# EAGLE design ncat (EAGLE 8.0.1)
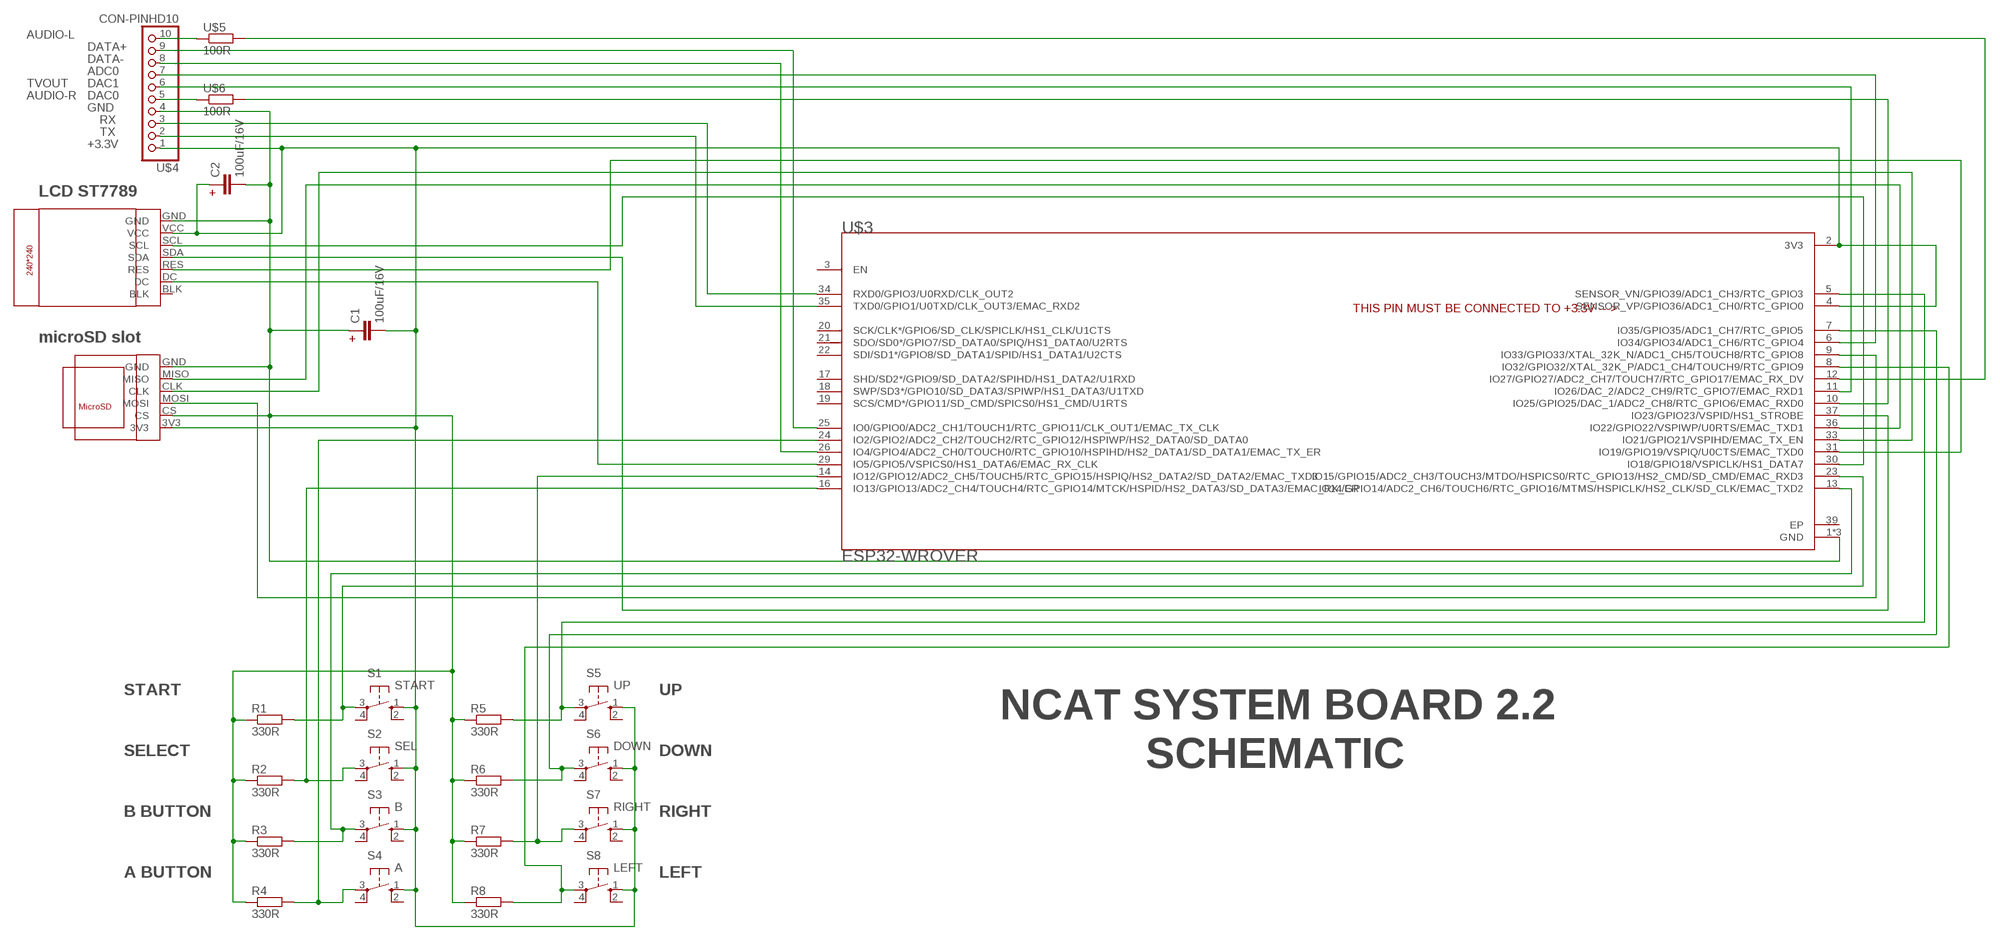
[diagram p0: schematic, sheet 1]

## Parts
C1  100uF/16V  C-EUC1210  [C1210]
C2  100uF/16V  C-EUC1210  [C1210]
R1  330R  RESISTORR204/5H  [R0204/5H]
R2  330R  RESISTORR204/5H  [R0204/5H]
R3  330R  RESISTORR204/5H  [R0204/5H]
R4  330R  RESISTORR204/5H  [R0204/5H]
R5  330R  RESISTORR204/5H  [R0204/5H]
R6  330R  RESISTORR204/5H  [R0204/5H]
R7  330R  RESISTORR204/5H  [R0204/5H]
R8  330R  RESISTORR204/5H  [R0204/5H]
S1  START  10-XX  [B3F-10XX]
S2  SEL  10-XX  [B3F-10XX]
S3  B  10-XX  [B3F-10XX]
S4  A  10-XX  [B3F-10XX]
S5  UP  10-XX  [B3F-10XX]
S6  DOWN  10-XX  [B3F-10XX]
S7  RIGHT  10-XX  [B3F-10XX]
S8  LEFT  10-XX  [B3F-10XX]
U$1  MICROSD-CARD-MODULESMD  [MICROSD-CARD-MODULE-SMD]
U$3  ESP32-WROVER  [XCVR-ESP32-WROVER]
U$4  CON-PINHD10  [PIN1X10]
U$5  100R  RESISTORR1206/SMD  [R1206/SMD]
U$6  100R  RESISTORR1206/SMD  [R1206/SMD]
U$7  LCD-ST7789-1.3INCH  [LCD-ST7789-1.3INCH]

## Nets
N$1: U$3.35(TXD0/GPIO1/U0TXD/CLK_OUT3/EMAC_RXD2) U$4.2
N$2: U$3.34(RXD0/GPIO3/U0RXD/CLK_OUT2) U$4.3
N$3: U$3.12(IO27/GPIO27/ADC2_CH7/TOUCH7/RTC_GPIO17/EMAC_RX_DV) U$5.2
N$4: U$4.5 U$6.1
N$5: U$4.10 U$5.1
N$6: U$3.11(IO26/DAC_2/ADC2_CH9/RTC_GPIO7/EMAC_RXD1) U$4.6
N$7: R8.2 S8.3(P) U$3.8(IO32/GPIO32/XTAL_32K_P/ADC1_CH4/TOUCH9/RTC_GPIO9)
N$12: R4.2 S4.3(P) U$3.24(IO2/GPIO2/ADC2_CH2/TOUCH2/RTC_GPIO12/HSPIWP/HS2_DATA0/SD_DATA0)
N$17: U$3.10(IO25/GPIO25/DAC_1/ADC2_CH8/RTC_GPIO6/EMAC_RXD0) U$6.2
N$18: U$3.30(IO18/GPIO18/VSPICLK/HS1_DATA7) U$7.SCL
N$19: U$3.37(IO23/GPIO23/VSPID/HS1_STROBE) U$7.SDA
N$20: U$3.31(IO19/GPIO19/VSPIQ/U0CTS/EMAC_TXD0) U$7.RES
N$21: R5.2 S5.3(P) U$3.5(SENSOR_VN/GPIO39/ADC1_CH3/RTC_GPIO3)
N$22: R2.2 S2.3(P) U$3.16(IO13/GPIO13/ADC2_CH4/TOUCH4/RTC_GPIO14/MTCK/HSPID/HS2_DATA3/SD_DATA3/EMAC_RX_ER)
N$24: R3.2 S3.3(P) U$3.13(IO14/GPIO14/ADC2_CH6/TOUCH6/RTC_GPIO16/MTMS/HSPICLK/HS2_CLK/SD_CLK/EMAC_TXD2)
N$46: U$1.MOSI U$3.9(IO33/GPIO33/XTAL_32K_N/ADC1_CH5/TOUCH8/RTC_GPIO8)
N$63: U$3.29(IO5/GPIO5/VSPICS0/HS1_DATA6/EMAC_RX_CLK) U$7.DC
N$64: U$1.MISO U$3.36(IO22/GPIO22/VSPIWP/U0RTS/EMAC_TXD1)
N$65: U$1.CLK U$3.33(IO21/GPIO21/VSPIHD/EMAC_TX_EN)
N$66: R6.2 S6.3(P) U$3.7(IO35/GPIO35/ADC1_CH7/RTC_GPIO5)
N$68: R1.2 S1.3(P) U$3.23(IO15/GPIO15/ADC2_CH3/TOUCH3/MTDO/HSPICS0/RTC_GPIO13/HS2_CMD/SD_CMD/EMAC_RXD3)
N$69: U$3.6(IO34/GPIO34/ADC1_CH6/RTC_GPIO4) U$4.7
N$70: U$3.26(IO4/GPIO4/ADC2_CH0/TOUCH0/RTC_GPIO10/HSPIHD/HS2_DATA1/SD_DATA1/EMAC_TX_ER) U$4.8
N$71: U$3.25(IO0/GPIO0/ADC2_CH1/TOUCH1/RTC_GPIO11/CLK_OUT1/EMAC_TX_CLK) U$4.9
N$72: C1.2 C2.1 S1.1(S) S2.1(S) S3.1(S) S4.1(S) S5.1(S) S6.1(S) S7.1(S) S8.1(S) U$1.3V3 U$3.2(3V3) U$3.4(SENSOR_VP/GPIO36/ADC1_CH0/RTC_GPIO0) U$4.1 U$7.VCC
N$73: R7.2 S7.3(P) U$3.14(IO12/GPIO12/ADC2_CH5/TOUCH5/RTC_GPIO15/HSPIQ/HS2_DATA2/SD_DATA2/EMAC_TXD3)
N$77: C1.1 C2.2 R1.1 R2.1 R3.1 R4.1 R5.1 R6.1 R7.1 R8.1 U$1.CS U$1.GND U$3.1(GND) U$3.15(GND) U$3.38(GND) U$4.4 U$7.GND
Unconnected: S1.2(S1) S1.4(P1) S2.2(S1) S2.4(P1) S3.2(S1) S3.4(P1) S4.2(S1) S4.4(P1) S5.2(S1) S5.4(P1) S6.2(S1) S6.4(P1) S7.2(S1) S7.4(P1) S8.2(S1) S8.4(P1) U$3.3(EN) U$3.17(SHD/SD2*/GPIO9/SD_DATA2/SPIHD/HS1_DATA2/U1RXD) U$3.18(SWP/SD3*/GPIO10/SD_DATA3/SPIWP/HS1_DATA3/U1TXD) U$3.19(SCS/CMD*/GPIO11/SD_CMD/SPICS0/HS1_CMD/U1RTS) U$3.20(SCK/CLK*/GPIO6/SD_CLK/SPICLK/HS1_CLK/U1CTS) U$3.21(SDO/SD0*/GPIO7/SD_DATA0/SPIQ/HS1_DATA0/U2RTS) U$3.22(SDI/SD1*/GPIO8/SD_DATA1/SPID/HS1_DATA1/U2CTS) U$7.BLK

## Notes on the sheet
- AUDIO-L
- DATA+
- DATA-
- ADC0
- TVOUT | DAC1
- AUDIO-R | DAC0
- GND
- RX
- TX
- +3.3V
- LCD ST7789 | +
- THIS PIN MUST BE CONNECTED TO +3.3V --->
- microSD slot | +
- START | UP
- NCAT SYSTEM BOARD 2.2
- SELECT | DOWN
- SCHEMATIC
- B BUTTON | RIGHT
- A BUTTON | LEFT

## Power pins joined to a net without a drawn wire
EP: U$3.39(EP)

## Library data of the parts
C1 C2 = resistor:C-EU: CAPACITOR, European symbol
R1-R8 U$5 U$6 = ncat:RESISTOR
S1-S8 = switch-omron:10-XX: OMRON SWITCH; MPN: B3F-1000; OC_FARNELL: 176432; OC_NEWARK: 36M3542
U$1 = MICROSD-CARD-MODULE_new:MICROSD-CARD-MODULE
U$3 = ncat:ESP32-WROVER
U$4 = ncat:CON-PINHD10
U$7 = ncat:LCD-ST7789-1.3INCH

## Board
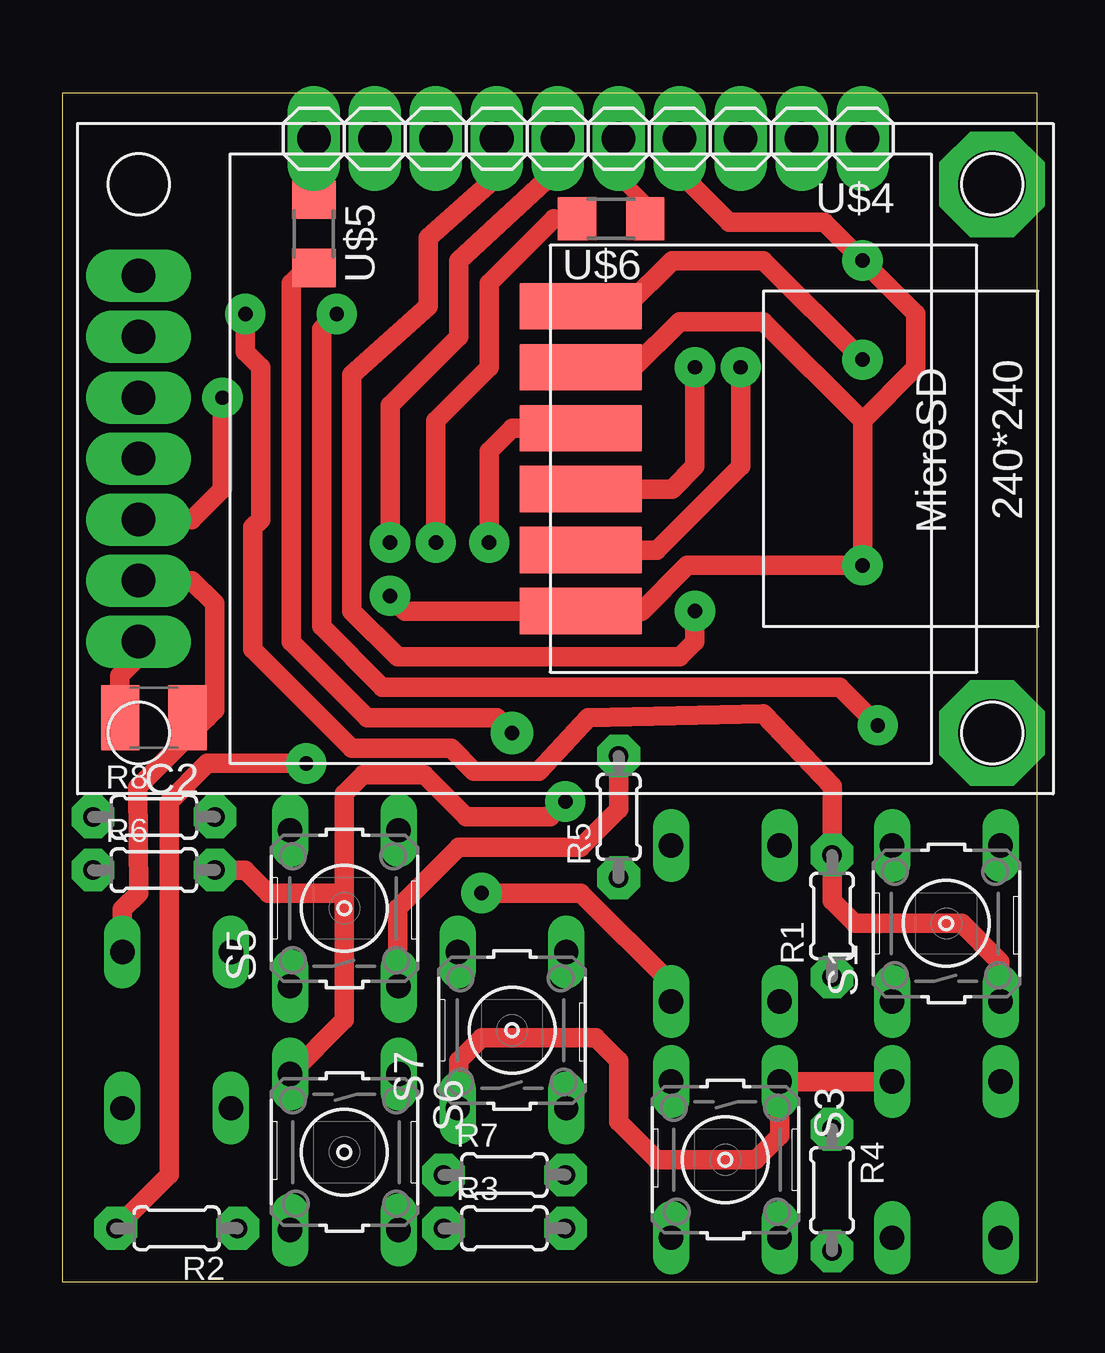
[diagram p1: board, top side]
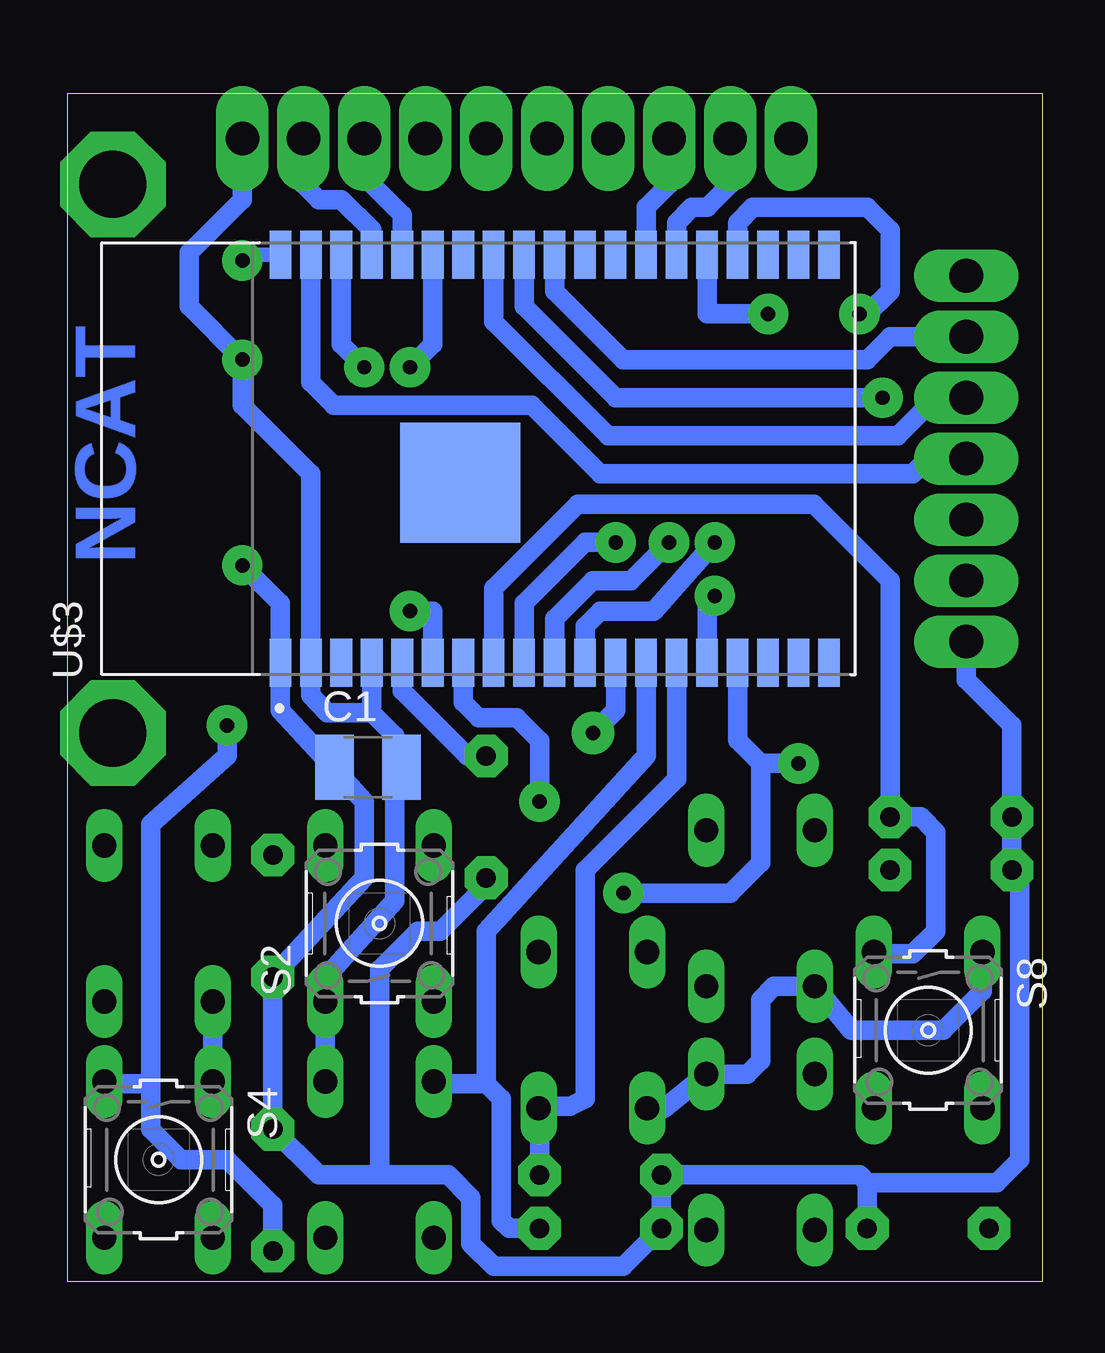
[diagram p2: board, bottom side, seen from below]

Size 40.62 x 49.52 mm. Coordinates in mm from the lower left corner, seen from the top.
Outline: 0,0 40.62,0 40.62,49.52 0,49.52 0,0
Copper layers (1*16): Top 0.035mm / dielectric 1.5mm / Bottom 0.035mm
Design rules "default": minimum track width 10mil, minimum drill 24mil, track to track 8mil, track to pad 8mil, pad to pad 8mil, via to via 8mil, smd to smd 8mil, copper to edge 40mil, drill to drill 8mil, minimum pad ring 10mil, minimum via ring 8mil, stop-mask expansion 4mil, vias tented up to drill 0mil, thermal gap 10mil

### Footprints (pad centres in the part's own frame; a part is rotated, then mirrored left to right if it is on the bottom)
C1210 = smd 1.6 x 2.7: 1 -1.4,0; 2 1.4,0
R0204/5H = drill 0.813 pad 1.778 octagon: 1 -2.54,0; 2 2.54,0
B3F-10XX = drill 1.016 long: 1 -3.251,2.261; 2 3.251,2.261; 3 -3.251,-2.261; 4 3.251,-2.261
MICROSD-CARD-MODULE-SMD = smd 1.93 x 5.08: 3V3 -6.35,-8.89; CLK 1.27,-8.89; CS -3.81,-8.89; GND 6.35,-8.89; MISO 3.81,-8.89; MOSI -1.27,-8.89
XCVR-ESP32-WROVER = smd 2 x 0.9: 1 -8.5,8.26; 2 -8.5,6.99; 3 -8.5,5.72; 4 -8.5,4.45; 5 -8.5,3.18; 6 -8.5,1.91; 7 -8.5,0.64; 8 -8.5,-0.63; 9 -8.5,-1.9; 10 -8.5,-3.17; 11 -8.5,-4.44; 12 -8.5,-5.71; 13 -8.5,-6.98; 14 -8.5,-8.25; 15 -8.5,-9.52; 16 -8.5,-10.79; 17 -8.5,-12.06; 18 -8.5,-13.33; 19 -8.5,-14.6; 20 8.5,-14.6; 21 8.5,-13.33; 22 8.5,-12.06; 23 8.5,-10.79; 24 8.5,-9.52; 25 8.5,-8.25; 26 8.5,-6.98; 27 8.5,-5.71; 28 8.5,-4.44; 29 8.5,-3.17; 30 8.5,-1.9; 31 8.5,-0.63; 32 8.5,0.64; 33 8.5,1.91; 34 8.5,3.18; 35 8.5,4.45; 36 8.5,5.72; 37 8.5,6.99; 38 8.5,8.26 | smd 5 x 5: 39 -1,0.76
PIN1X10 = drill 1.4 pad 2.184 long: 1 -11.43,0; 2 -8.89,0; 3 -6.35,0; 4 -3.81,0; 5 -1.27,0; 6 1.27,0; 7 3.81,0; 8 6.35,0; 9 8.89,0; 10 11.43,0
R1206/SMD = smd 1.6 x 1.803: 1 -1.422,0; 2 1.422,0
LCD-ST7789-1.3INCH = drill 1.4 pad 2.184 long: BLK -7.62,-19.05; DC -5.08,-19.05; GND 7.62,-19.05; RES -2.54,-19.05; SCL 2.54,-19.05; SDA 0,-19.05; VCC 5.08,-19.05

### Placement (x,y rotation side)
C1  28.1,21.43 0 bottom
C2  3.81,23.5 180 top
R1  32.07,15.24 90 top
R2  4.76,2.22 180 top
R3  18.41,2.22 0 top
R4  32.07,3.81 270 top
R5  23.18,19.37 90 top
R6  3.81,17.14 0 top
R7  18.41,4.45 0 top
R8  3.81,19.37 0 top
S1  36.83,14.92 90 top
S2  27.62,14.92 90 bottom
S3  27.62,5.08 270 top
S4  36.83,5.08 270 bottom
S5  11.75,15.56 90 top
S6  11.75,5.4 270 top
S7  18.73,10.48 90 top
S8  4.76,10.48 270 bottom
U$1  30.48,34.29 270 top
U$3  23.5,34.29 90 bottom
U$4  21.91,47.62 180 top
U$5  10.48,43.66 270 top
U$6  22.86,44.29 180 top
U$7  22.23,34.29 270 top

### Tracks (layer width: path | path; a pad name or v marks a point on that pad's centre or on a via)
N$1
  Bottom 0.813: U$3.35 27.95,43.82 29.21,45.09 30.16,45.09 30.8,45.72 U$4.2
N$2
  Bottom 0.813: U$4.3 28.26,46.04 26.67,44.45 U$3.34
N$3  (via drill 0.6 pad 1.78)
  Top 0.61: U$5.2 10.48,42.55
  Top 0.813: 10.48,42.55 9.53,41.59 9.53,26.67 12.7,23.5 18.1,23.5 v18.73,22.86
  Bottom 0.813: v18.73,22.86 17.78,23.81 U$3.12
N$4
  Top 0.61: U$6.1 24.28,44.93 23.18,46.04 U$4.5
N$5
  Top 0.61: U$5.1 U$4.10
N$6  (via drill 0.6 pad 1.68)
  Top 0.813: v13.65,30.8 13.65,36.51 16.51,39.37 16.51,42.55 20.64,46.35 U$4.6
  Bottom 0.813: U$3.11 19.05,27.3 18.41,27.94 16.19,27.94 v13.65,30.8
N$7
  Bottom 0.813: S8.3 6.95,13.65 5.4,13.65 4.45,14.61 4.45,18.73 5.08,19.37 R8.2 6.35,29.21 9.53,32.38 19.37,32.38 22.86,28.89 U$3.8
N$12  (via drill 0.6 pad 1.68)
  Top 0.813: v11.43,40.32 10.79,39.69 10.79,27.3 13.34,24.77 32.38,24.77 v33.97,23.18
  Bottom 0.813: 37.15,8.26 37.15,6.35 35.88,5.08 33.97,5.08 32.07,3.17 R4.2 | U$3.24 13.97,40.33 v11.43,40.32 | v33.97,23.18 33.97,21.91 37.15,19.05 37.15,8.26 | 37.15,8.26 39.01,8.26 S4.3
N$17  (via drill 0.6 pad 1.68)
  Top 0.61: U$6.2 20.48,44.29
  Top 0.813: 20.48,44.29 17.78,41.59 17.78,38.1 15.56,35.88 v15.56,30.8
  Bottom 0.813: v15.56,30.8 17.14,29.21 18.73,29.21 20.32,27.62 U$3.10
N$18  (via drill 0.6 pad 1.68)
  Top 0.813: v6.67,36.83 6.67,33.02 5.4,31.75 U$7.SCL
  Bottom 0.813: U$3.30 21.59,40.65 17.78,36.83 v6.67,36.83
N$19
  Bottom 0.813: U$7.SDA 4.76,34.29 5.4,33.66 18.41,33.66 21.27,36.51 29.53,36.51 30.48,37.47 U$3.37
N$20
  Bottom 0.813: U$7.RES 4.45,36.83 6.03,35.24 18.1,35.24 22.86,40.01 U$3.31
N$21
  Top 0.813: S5.3 13.97,12.34 13.97,15.56 16.51,18.1 21.59,18.1 23.18,19.68 R5.2
  Bottom 0.813: U$3.5 26.68,24.61 23.97,21.91 R5.2 22.86,21.91
N$22  (via drill 0.6 pad 1.68)
  Top 0.813: v17.46,16.19 21.59,16.19 25.4,12.38 25.4,11.71 S2.3 | v10.16,21.59 6.03,21.59 4.45,20 4.45,4.45 R2.2
  Bottom 0.813: U$3.16 12.71,22.55 11.75,21.59 | 11.75,21.59 11.75,17.46 13.02,16.19 v17.46,16.19 | 11.75,21.59 v10.16,21.59
N$24
  Bottom 0.813: U$3.13 16.52,21.9 23.18,14.61 23.18,8.26 | 23.18,8.26 22.54,7.62 22.54,2.54 22.23,2.22 R3.2 | 23.18,8.26 25.29,8.26 S3.3
N$46  (via drill 0.6 pad 1.68)
  Top 0.813: U$1.MOSI 18.73,35.56 17.78,34.61 v17.78,30.8
  Bottom 0.813: U$3.9 21.59,26.98 21.59,28.26 19.05,30.8 v17.78,30.8
N$63
  Bottom 0.813: U$7.DC 6.35,39.37 7.3,38.42 17.46,38.42 20.32,41.27 U$3.29
N$64  (via drill 0.6 pad 1.68)
  Top 0.813: v28.26,38.1 28.26,33.97 24.77,30.48 U$1.MISO
  Bottom 0.813: U$3.36 29.21,39.06 v28.26,38.1
N$65  (via drill 0.6 pad 1.68)
  Top 0.813: v26.35,38.1 26.35,33.97 25.4,33.02 U$1.CLK
  Bottom 0.813: U$3.33 25.41,39.05 v26.35,38.1
N$66  (via drill 0.6 pad 1.68)
  Top 0.813: v20.95,20 20.32,19.37 16.83,19.37 15.08,21.11 12.54,21.11 11.75,20.32 11.75,16.19 | 11.75,16.19 11.75,10.91 S6.3 | R6.2 7.62,17.14 8.57,16.19 11.75,16.19
  Bottom 0.813: U$3.7 24.14,24.14 23.5,23.5 21.91,23.5 20.95,22.54 v20.95,20
N$68  (via drill 0.6 pad 1.68)
  Top 0.813: v7.62,40.32 7.62,38.73 8.26,38.1 8.26,31.75 7.94,31.43 7.94,26.35 12.06,22.23 16.19,22.23 17.14,21.27 19.84,21.27 21.91,23.5 29.21,23.65 32.07,20.64 R1.2 32.07,15.88 33.02,14.92 37.47,14.92 39.05,13.34 39.05,11.71 S1.3
  Bottom 0.813: U$3.23 12.71,44.13 12.06,44.77 7.3,44.77 6.35,43.81 6.35,41.27 7.3,40.32 v7.62,40.32
N$69  (via drill 0.6 pad 1.68)
  Top 0.813: v26.35,27.94 26.35,26.67 25.72,26.04 13.97,26.04 12.06,27.94 12.06,37.78 15.24,40.64 15.24,43.5 18.1,46.04 U$4.7
  Bottom 0.813: U$3.6 25.41,27.93 25.4,27.94 v26.35,27.94
N$70
  Bottom 0.813: U$4.8 15.56,45.72 16.51,44.77 U$3.26
N$71
  Bottom 0.813: U$3.25 15.24,44.13 14.61,44.77 13.97,44.77 13.02,45.72 U$4.9
N$72  (via drill 0.6 pad 1.68)
  Top 0.813: S4.1 S3.1 29.88,6.07 28.89,5.08 24.77,5.08 23.18,6.67 23.18,9.21 22.23,10.16 17.46,10.16 16.51,9.21 16.51,7.26 S7.1 | v33.34,38.42 29.21,42.55 25.4,42.55 23.5,40.64 U$1.3V3 | S8.1 2.5,15.52 3.17,16.19 3.14,20.6 6.03,23.5 | 6.03,23.5 6.35,23.81 6.35,28.26 5.4,29.21 U$7.VCC | C2.1 6.03,23.65 6.03,23.5
  Bottom 0.813: U$3.4 27.95,23.7 | S7.1 15.75,7.23 S6.1 12.31,8.65 11.75,9.21 11.75,11.75 11.19,12.31 S5.1 7.98,10.48 4.13,10.48 2.5,12.1 S8.1 | 34.49,8.26 S4.1 S1.1 | 29.96,8.26 S3.1 S2.1 29.84,11.71 29.84,12.7 26.99,15.88 26.99,21.43 | U$4.1 33.34,45.09 35.56,42.86 35.56,40.64 v33.34,38.42 33.34,36.51 30.48,33.66 U$3.2 30.48,24.44 29.8,23.7 27.95,23.7 | 27.95,23.7 26.99,22.74 26.99,21.43 | C1.2 26.99,21.43
N$73
  Bottom 0.813: R7.2 20.95,7.19 S7.3 20.92,7.3 19.68,7.3 19.05,7.62 19.05,17.14 15.24,20.95 U$3.14
N$74  (via drill 2.8 pad 4.4)
  other vias: 38.73,45.72
N$75  (via drill 2.8 pad 4.4)
  other vias: 38.73,22.86
N$77  (via drill 0.6 pad 1.68)
  Top 0.813: U$4.4 25.72,46.2 27.78,44.13 31.75,44.13 v33.34,42.55 35.56,40.32 35.56,38.1 33.34,35.88 | v13.65,28.57 14.29,27.94 U$1.GND 24.13,27.94 26.04,29.84 v33.34,29.84 33.34,35.88 | U$1.CS 23.81,38.1 25.72,40.01 29.21,40.01 33.34,35.88 | C2.2 2.38,25.08 2.38,25.24 3.17,26.04 U$7.GND
  Bottom 0.61: U$3.38 33.02,42.79 v33.34,42.55
  Bottom 0.813: 29.47,21.32 28.26,20 28.26,16.83 R1.1 R4.1 30.16,4.45 27.62,4.45 | 29.47,21.32 31.75,23.81 U$3.1 31.75,28.26 v33.34,29.84 | U$3.15 13.97,28.25 v13.65,28.57 | U$7.GND 3.17,25.08 1.27,23.18 R8.1 R6.1 0.95,16.83 0.95,5.08 1.91,4.13 7.3,4.13 | 7.3,4.13 7.62,4.45 R7.1 R3.1 17.46,0.64 22.86,0.64 23.81,1.59 23.81,3.49 24.77,4.45 27.62,4.45 | R2.1 7.3,4.13 | R5.1 23.18,16.51 25.08,14.61 26.04,14.61 27.62,13.02 27.62,4.45 | C1.1 29.47,21.43 29.47,21.32

### Text on the board
Bottom: NCAT